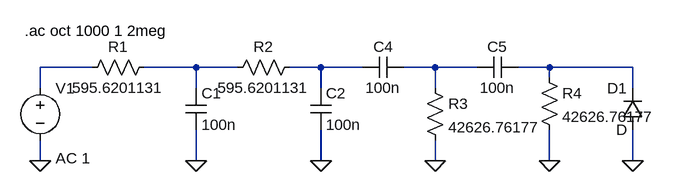
[diagram p0: schematic bpf_2nd_ord_100hz-1khz_cutoff.asc]
bpf_2nd_ord_100hz-1khz_cutoff.asc, the LTspice schematic file:
Version 4.1
SHEET 1 1024 680
WIRE 144 96 64 96
WIRE 304 96 224 96
WIRE 368 96 304 96
WIRE 496 96 448 96
WIRE 560 96 496 96
WIRE 672 96 624 96
WIRE 736 96 672 96
WIRE 848 96 800 96
WIRE 976 96 848 96
WIRE 848 112 848 96
WIRE 64 128 64 96
WIRE 304 128 304 96
WIRE 496 128 496 96
WIRE 672 128 672 96
WIRE 976 128 976 96
WIRE 64 240 64 208
WIRE 304 240 304 192
WIRE 496 240 496 192
WIRE 672 240 672 208
WIRE 848 240 848 192
WIRE 976 240 976 192
FLAG 304 240 0
FLAG 64 240 0
FLAG 672 240 0
FLAG 848 240 0
FLAG 496 240 0
FLAG 976 240 0
SYMBOL voltage 64 112 R0
WINDOW 3 24 152 Left 2
WINDOW 123 24 124 Left 2
WINDOW 39 0 0 Left 0
SYMATTR Value ""
SYMATTR Value2 AC 1
SYMATTR InstName V1
SYMBOL res 240 80 R90
WINDOW 0 0 56 VBottom 2
WINDOW 3 32 56 VTop 2
SYMATTR InstName R1
SYMATTR Value 595.6201131
SYMBOL cap 288 128 R0
SYMATTR InstName C1
SYMATTR Value 100n
SYMBOL res 464 80 R90
WINDOW 0 0 56 VBottom 2
WINDOW 3 32 56 VTop 2
SYMATTR InstName R2
SYMATTR Value 595.6201131
SYMBOL cap 624 80 R90
WINDOW 0 0 32 VBottom 2
WINDOW 3 32 32 VTop 2
SYMATTR InstName C4
SYMATTR Value 100n
SYMBOL cap 800 80 R90
WINDOW 0 0 32 VBottom 2
WINDOW 3 32 32 VTop 2
SYMATTR InstName C5
SYMATTR Value 100n
SYMBOL res 656 112 R0
SYMATTR InstName R3
SYMATTR Value 42626.76177
SYMBOL res 832 96 R0
SYMATTR InstName R4
SYMATTR Value 42626.76177
SYMBOL cap 480 128 R0
SYMATTR InstName C2
SYMATTR Value 100n
SYMBOL diode 992 192 R180
WINDOW 0 24 64 Left 2
WINDOW 3 24 0 Left 2
SYMATTR InstName D1
TEXT 40 40 Left 2 !.ac oct 1000 1 2meg

The netlist it stands for:
* bpf_2nd_ord_100hz-1khz_cutoff.asc
V1 N001 0 AC 1
R1 N002 N001 595.6201131
C1 N002 0 100n
R2 N003 N002 595.6201131
C4 N004 N003 100n
C5 N005 N004 100n
R3 N004 0 42626.76177
R4 N005 0 42626.76177
C2 N003 0 100n
D1 0 N005 D
.model D D
.lib standard.dio
.ac oct 1000 1 2meg
.backanno
.end